# EAGLE design USAF Design Unrouted (EAGLE 5.11)
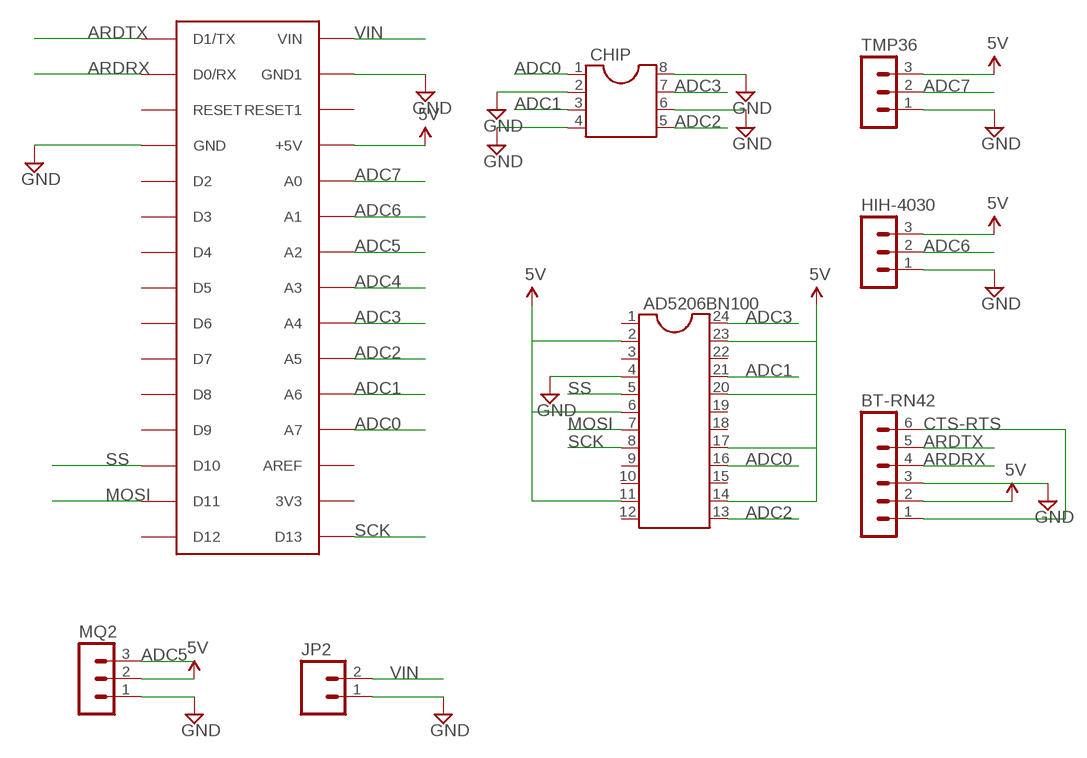
[diagram p0: schematic, sheet 1]

## Parts
AD5206BN100  DIL24-3  [DIL24-3]
BT-RN42  MA06-1  [MA06-1]
CHIP  DIL8S  [SOCKET-08]
HIH-4030  MA03-1  [MA03-1]
JP2  M02PTH  [1X02]
MQ2  MA03-1  [MA03-1]
TMP36  MA03-1  [MA03-1]
U$1  ARDUINONANO  [PDIP-32]

## Nets
5V: AD5206BN100.2 AD5206BN100.6 AD5206BN100.11 AD5206BN100.14 AD5206BN100.17 AD5206BN100.20 AD5206BN100.23 BT-RN42.2 HIH-4030.3 MQ2.2 TMP36.3 U$1.+5V
ADC0: AD5206BN100.16 CHIP.1 U$1.A7
ADC1: AD5206BN100.21 CHIP.3 U$1.A6
ADC2: AD5206BN100.13 CHIP.5 U$1.A5
ADC3: AD5206BN100.24 CHIP.7 U$1.A4
ADC4: U$1.A3
ADC5: MQ2.3 U$1.A2
ADC6: HIH-4030.2 U$1.A1
ADC7: TMP36.2 U$1.A0
ARDRX: BT-RN42.4 U$1.D0/RX
ARDTX: BT-RN42.5 U$1.D1/TX
CTS-RTS: BT-RN42.1 BT-RN42.6
GND: AD5206BN100.4 BT-RN42.3 CHIP.2 CHIP.4 CHIP.6 CHIP.8 HIH-4030.1 JP2.1 MQ2.1 TMP36.1 U$1.GND U$1.GND1
MOSI: AD5206BN100.7 U$1.D11
SCK: AD5206BN100.8 U$1.D13
SS: AD5206BN100.5 U$1.D10
VIN: JP2.2 U$1.VIN
Unconnected: AD5206BN100.1 AD5206BN100.3 AD5206BN100.9 AD5206BN100.10 AD5206BN100.12 AD5206BN100.15 AD5206BN100.18 AD5206BN100.19 AD5206BN100.22 U$1.3V3 U$1.AREF U$1.D2 U$1.D3 U$1.D4 U$1.D5 U$1.D6 U$1.D7 U$1.D8 U$1.D9 U$1.D12 U$1.RESET U$1.RESET1

## Library data of the parts
AD5206BN100 = ic-package:DIL24: Dual In Line
BT-RN42 = con-lstb:MA06-1: PIN HEADER; OC_FARNELL: unknown; OC_NEWARK: unknown
CHIP = ic-package:DIL8: Dual In Line / Socket
HIH-4030 MQ2 TMP36 = con-lstb:MA03-1: PIN HEADER; OC_FARNELL: unknown; OC_NEWARK: unknown
JP2 = SparkFun:M02: Header 2 Standard 2-pin 0.1" header. Use with straight break away headers (SKU : PRT-00116), right angle break away headers (PRT-00553), swiss pins (PRT-00743), machine pins (PRT-00117), and female headers (PRT-00115). Molex polarized connector foot print use with SKU : PRT-08233 with associated crimp pins and housings.
U$1 = jet-lib:ARDUINONANO

## Board
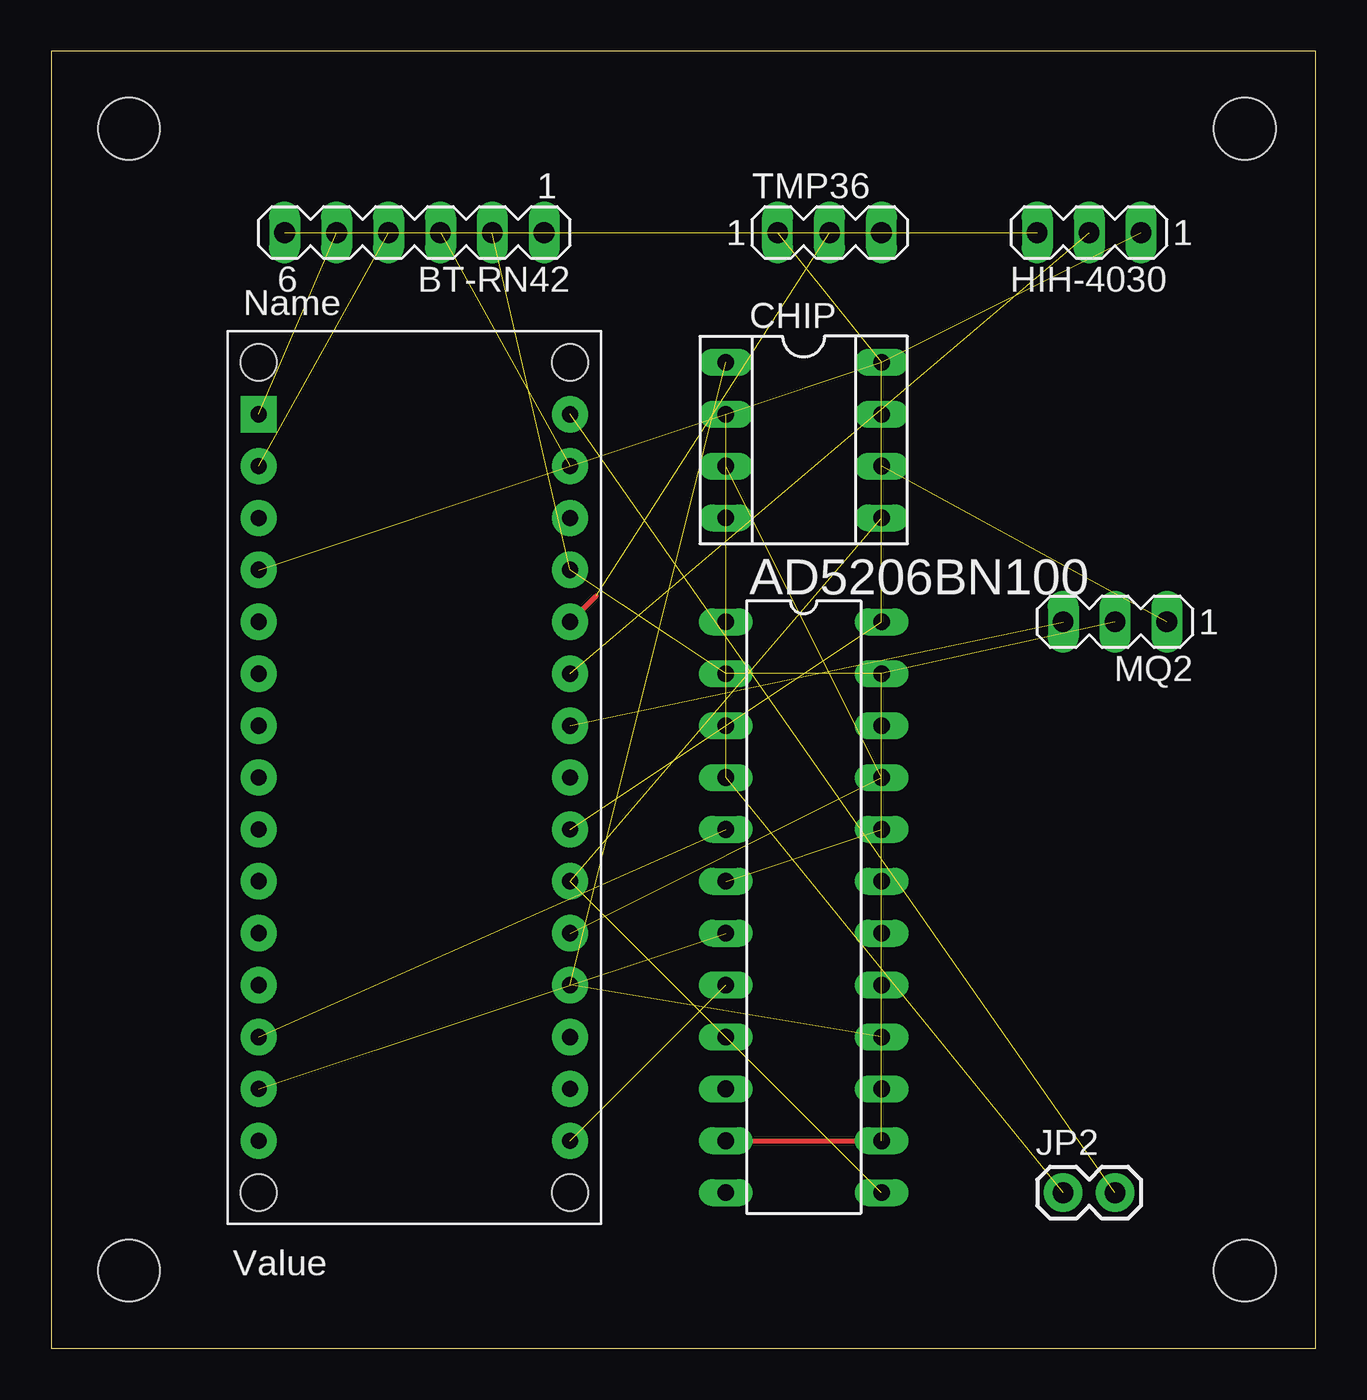
[diagram p1: board, top side]

Size 61.9 x 63.49 mm. Coordinates in mm from the lower left corner, seen from the top.
Outline: 0,0 61.9,0 61.9,63.49 0,63.49 0,0
Copper layers (1*16): Top 0.035mm / dielectric 1.5mm / Bottom 0.035mm
Design rules "default": minimum track width 10mil, minimum drill 24mil, track to track 8mil, track to pad 8mil, pad to pad 8mil, via to via 8mil, smd to smd 8mil, copper to edge 40mil, drill to drill 8mil, minimum pad ring 10mil, minimum via ring 8mil, stop-mask expansion 4mil, vias tented up to drill 0mil, thermal gap 10mil
Holes 3.02 mm at 3.81,59.69 58.42,59.69 3.81,3.81 58.42,3.81

### Footprints (pad centres in the part's own frame; a part is rotated, then mirrored left to right if it is on the bottom)
DIL24-3 = drill 0.813 long: 1 -13.97,-3.81; 2 -11.43,-3.81; 3 -8.89,-3.81; 4 -6.35,-3.81; 5 -3.81,-3.81; 6 -1.27,-3.81; 7 1.27,-3.81; 8 3.81,-3.81; 9 6.35,-3.81; 10 8.89,-3.81; 11 11.43,-3.81; 12 13.97,-3.81; 13 13.97,3.81; 14 11.43,3.81; 15 8.89,3.81; 16 6.35,3.81; 17 3.81,3.81; 18 1.27,3.81; 19 -1.27,3.81; 20 -3.81,3.81; 21 -6.35,3.81; 22 -8.89,3.81; 23 -11.43,3.81; 24 -13.97,3.81
MA06-1 = drill 1.016 long: 1 -6.35,0; 2 -3.81,0; 3 -1.27,0; 4 1.27,0; 5 3.81,0; 6 6.35,0
SOCKET-08 = drill 0.813 long: 1 -3.81,-3.81; 2 -1.27,-3.81; 3 1.27,-3.81; 4 3.81,-3.81; 5 3.81,3.81; 6 1.27,3.81; 7 -1.27,3.81; 8 -3.81,3.81
MA03-1 = drill 1.016 long: 1 -2.54,0; 2 0,0; 3 2.54,0
1X02 = drill 1.016 pad 1.88 round: 1 0,0; 2 2.54,0
PDIP-32 = drill 0.8 pad 1.778 round: 3V3 15.24,-35.56; +5V 15.24,-10.16; A0 15.24,-12.7; A1 15.24,-15.24; A2 15.24,-17.78; A3 15.24,-20.32; A4 15.24,-22.86; A5 15.24,-25.4; A6 15.24,-27.94; A7 15.24,-30.48; AREF 15.24,-33.02; D0/RX 0,-5.08; D2 0,-12.7; D3 0,-15.24; D4 0,-17.78; D5 0,-20.32; D6 0,-22.86; D7 0,-25.4; D8 0,-27.94; D9 0,-30.48; D10 0,-33.02; D11 0,-35.56; D12 0,-38.1; D13 15.24,-38.1; GND 0,-10.16; GND1 15.24,-5.08; RESET 0,-7.62; RESET1 15.24,-7.62; VIN 15.24,-2.54 | drill 0.8 pad 1.778 square: D1/TX 0,-2.54 | hole 1.778: 0,0; 0,-40.64; 15.24,-40.64; 15.24,0

### Placement (x,y rotation side)
AD5206BN100  36.83,21.59 270 top
BT-RN42  17.78,54.61 180 top
CHIP  36.83,44.45 270 top
HIH-4030  50.8,54.61 180 top
JP2  49.53,7.62 0 top
MQ2  52.07,35.56 180 top
TMP36  38.1,54.61 0 top
U$1  10.16,48.26 0 top

### Tracks (layer width: path | path; a pad name or v marks a point on that pad's centre or on a via)
5V  (10 unrouted)
  Top 0.254: AD5206BN100.11 AD5206BN100.14
ADC0  (2 unrouted)
ADC1  (2 unrouted)
ADC2  (2 unrouted)
ADC3  (2 unrouted)
ADC5  (1 unrouted)
ADC6  (1 unrouted)
ADC7  (1 unrouted)
  Top 0.254: U$1.A0 26.67,36.83
ARDRX  (1 unrouted)
ARDTX  (1 unrouted)
CTS-RTS  (1 unrouted)
GND  (11 unrouted)
MOSI  (1 unrouted)
SCK  (1 unrouted)
SS  (1 unrouted)
VIN  (1 unrouted)